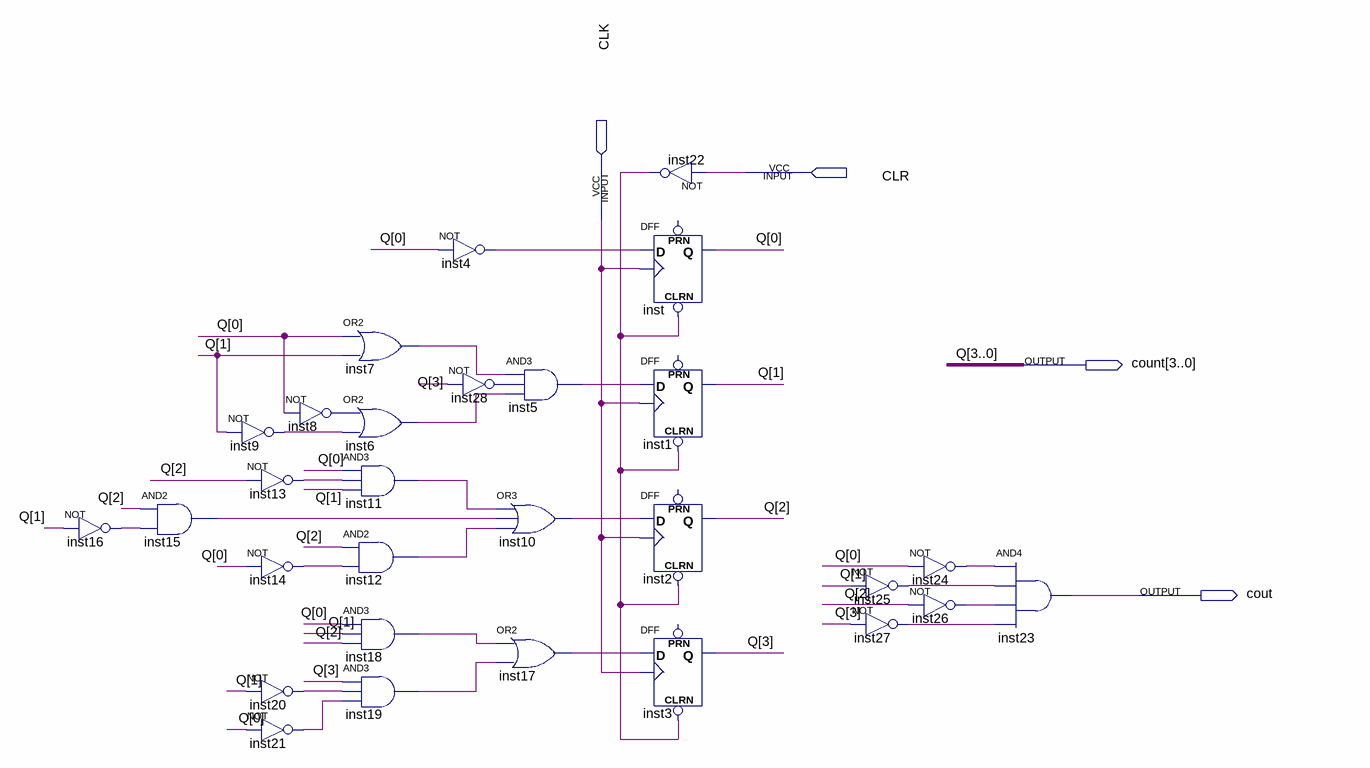
[diagram p0: schematic sheet]
// Quartus schematic ten_counter.bdf as structural Verilog: 29 symbols, 4 pins
module ten_counter (
  input  CLR,
  input  CLK,
  output [3:0] count,
  output cout
);

  wire inst4_out, inst5_out, inst6_out, inst7_out, inst8_out, inst9_out, inst10_out, inst11_out, inst12_out,
       inst13_out, inst14_out, inst15_out, inst16_out, inst17_out, inst18_out, inst19_out, inst20_out,
       inst21_out, inst22_out, inst24_out, inst25_out, inst26_out, inst27_out, inst28_out;

  not inst16 (inst16_out, count[1]);
  and inst15 (inst15_out, count[2], inst16_out);
  not inst8 (inst8_out, count[0]);
  not inst9 (inst9_out, count[1]);
  not inst13 (inst13_out, count[2]);
  not inst14 (inst14_out, count[0]);
  not inst20 (inst20_out, count[1]);
  not inst21 (inst21_out, count[0]);
  or inst7 (inst7_out, count[0], count[1]);
  or inst6 (inst6_out, inst8_out, inst9_out);
  and inst11 (inst11_out, count[0], inst13_out, count[1]);
  and inst12 (inst12_out, count[2], inst14_out);
  and inst18 (inst18_out, count[0], count[1], count[2]);
  and inst19 (inst19_out, count[3], inst20_out, inst21_out);
  not inst4 (inst4_out, count[0]);
  not inst28 (inst28_out, count[3]);
  and inst5 (inst5_out, inst7_out, inst28_out, inst6_out);
  or inst10 (inst10_out, inst11_out, inst15_out, inst12_out);
  or inst17 (inst17_out, inst18_out, inst19_out);
  not inst22 (inst22_out, CLR);
  DFF inst (.CLRN(inst22_out), .CLK(CLK), .D(inst4_out), .Q(count[0]));  // open: PRN
  DFF inst1 (.CLRN(inst22_out), .CLK(CLK), .D(inst5_out), .Q(count[1]));  // open: PRN
  DFF inst2 (.CLRN(inst22_out), .CLK(CLK), .D(inst10_out), .Q(count[2]));  // open: PRN
  DFF inst3 (.CLRN(inst22_out), .CLK(CLK), .D(inst17_out), .Q(count[3]));  // open: PRN
  not inst24 (inst24_out, count[0]);
  not inst25 (inst25_out, count[1]);
  not inst26 (inst26_out, count[2]);
  not inst27 (inst27_out, count[3]);
  and inst23 (cout, inst24_out, inst25_out, inst26_out, inst27_out);

  // Other names for the same wires on the sheet: Q[3:0] = count
endmodule
